# Altium schematic sheet wifi.SchDoc
size Legal; CompanyName: Brinton Engineering, LLC; Address1: 3479 Edison Way; Address2: Menlo Park CA 94025; Address3: +1 (877) 778-8435; Address4: brintonengineering.com; Revision: 1; SheetNumber: 1; SheetTotal: 1
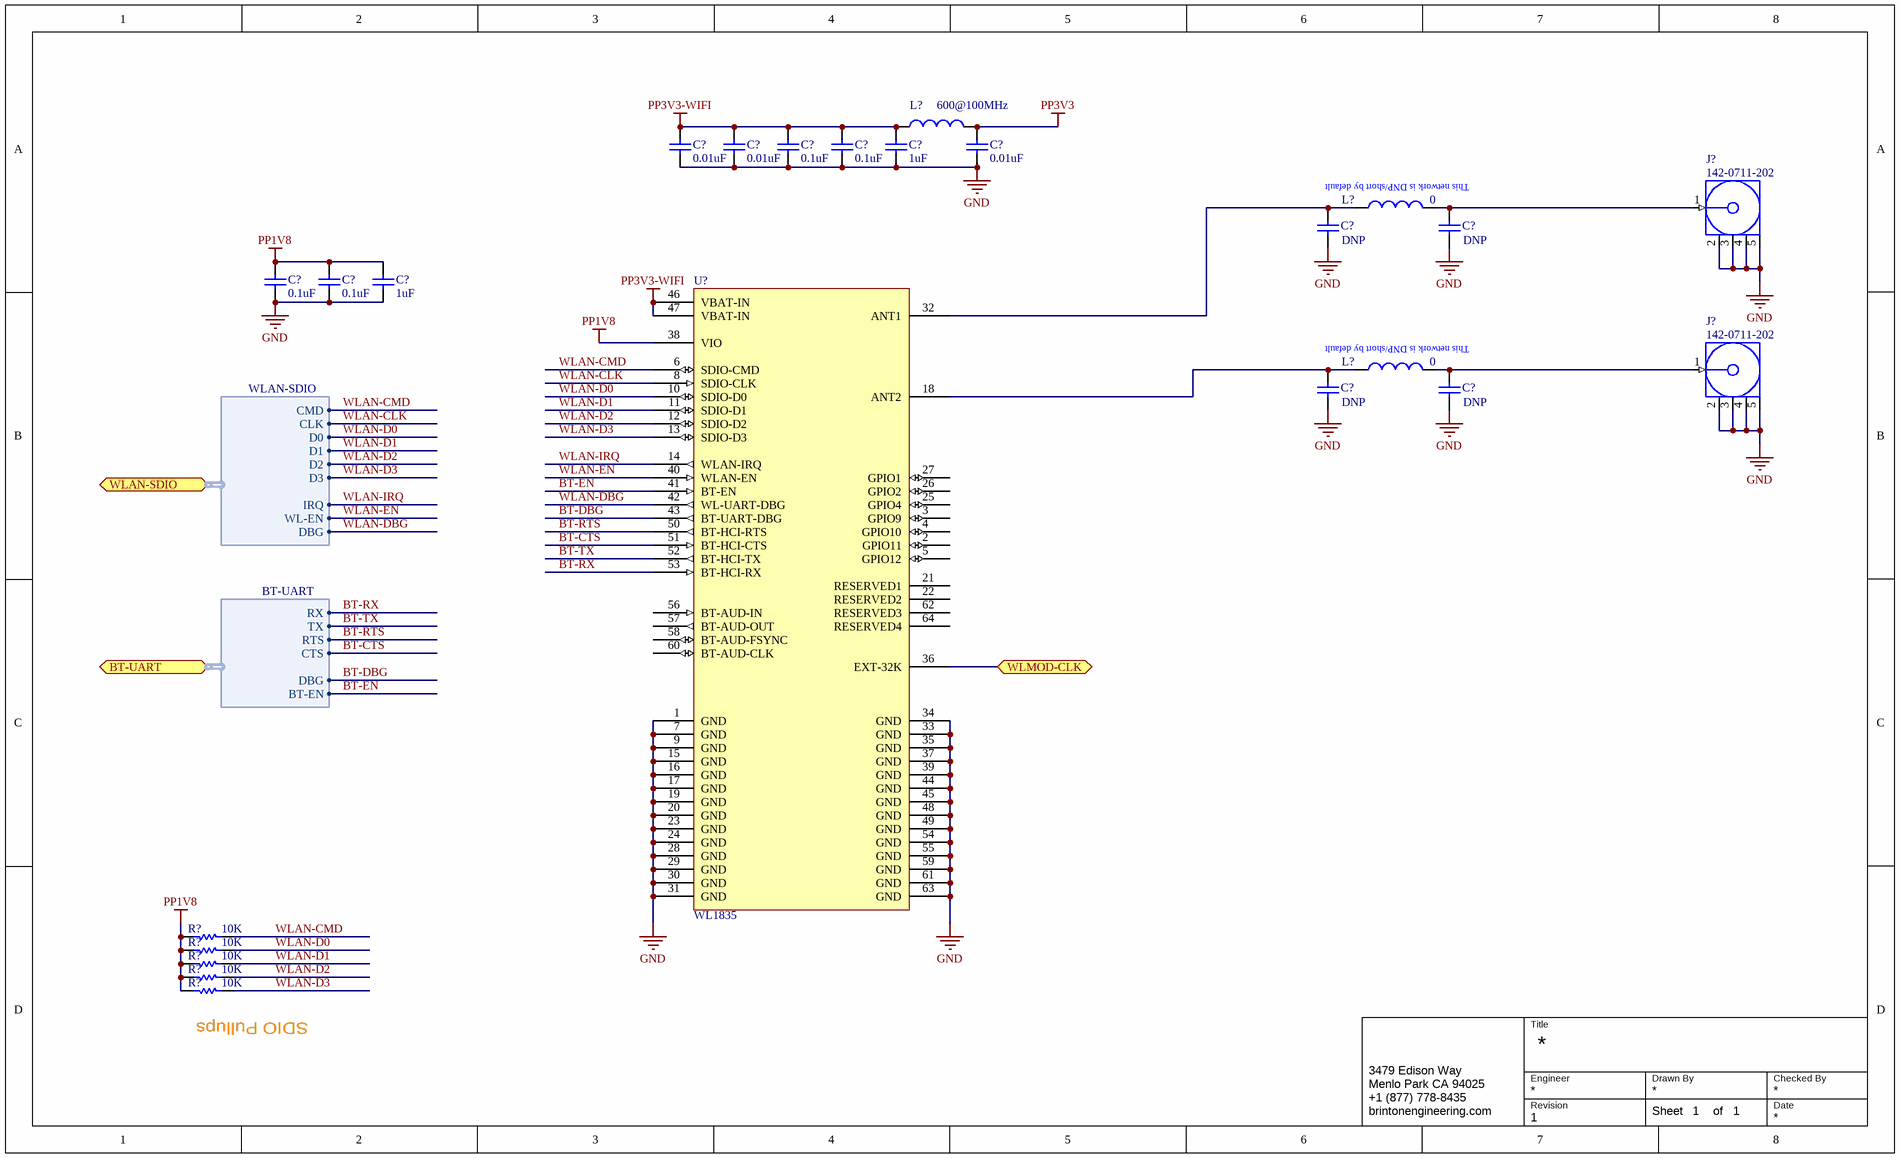
[diagram p0: wifi.SchDoc]

## Parts
(Parts that share a designator on the sheet are numbered #1, #2 ... from top to bottom, then left to right.)
C?#1  value 0.01uF  [0402]  (hidden comment: CAP 0402)
C?#2  value 0.01uF  [0402]  (hidden comment: CAP 0402)
C?#3  value 0.1uF  [0402]  (hidden comment: CAP 0402)
C?#4  value 0.1uF  [0402]  (hidden comment: CAP 0402)
C?#5  value 1uF  [0402]  (hidden comment: CAP 0402)
C?#6  value 0.01uF  [0402]  (hidden comment: CAP 0402)
C?#7  Do Not Populate: DNP  [0402]  (hidden comment: CAP 0402)
C?#8  Do Not Populate: DNP  [0402]  (hidden comment: CAP 0402)
C?#9  value 0.1uF  [0402]  (hidden comment: CAP 0402)
C?#10  value 0.1uF  [0402]  (hidden comment: CAP 0402)
C?#11  value 1uF  [0402]  (hidden comment: CAP 0402)
C?#12  Do Not Populate: DNP  [0402]  (hidden comment: CAP 0402)
C?#13  Do Not Populate: DNP  [0402]  (hidden comment: CAP 0402)
J?#1  142-0711-202  [142-0711-202]
J?#2  142-0711-202  [142-0711-202]
L?#1  value 600@100MHz  [0402]  (hidden comment: IND 0402)
L?#2  value 0  [0603]  (hidden comment: IND 0603)
L?#3  value 0  [0603]  (hidden comment: IND 0603)
R?#1  value 10K  [0402]  (hidden comment: RES 0402)
R?#2  value 10K  [0402]  (hidden comment: RES 0402)
R?#3  value 10K  [0402]  (hidden comment: RES 0402)
R?#4  value 10K  [0402]  (hidden comment: RES 0402)
R?#5  value 10K  [0402]  (hidden comment: RES 0402)
U?  WL1835

## Ports
BT-UART (harness BT-UART), WLAN-SDIO (harness WLAN-SDIO), WLMOD-CLK

## Harnesses
WLAN-SDIO: CMD, CLK, D0, D1, D2, D3, IRQ, WL-EN, DBG
BT-UART: RX, TX, RTS, CTS, DBG, BT-EN

## Nets
GND: C?#1.1 C?#2.1 C?#3.1 C?#4.1 C?#5.1 C?#6.1 C?#7.1 C?#8.1 C?#9.1 C?#10.1 C?#11.1 C?#12.1 C?#13.1 J?#1.2(GND) J?#1.3(GND) J?#1.4(GND) J?#1.5(GND) J?#2.2(GND) J?#2.3(GND) J?#2.4(GND) J?#2.5(GND) U?.1(GND) U?.7(GND) U?.9(GND) U?.15(GND) U?.16(GND) U?.17(GND) U?.19(GND) U?.20(GND) U?.23(GND) U?.24(GND) U?.28(GND) U?.29(GND) U?.30(GND) U?.31(GND) U?.33(GND) U?.34(GND) U?.35(GND) U?.37(GND) U?.39(GND) U?.44(GND) U?.45(GND) U?.48(GND) U?.49(GND) U?.54(GND) U?.55(GND) U?.59(GND) U?.61(GND) U?.63(GND)
PP1V8: C?#9.2 C?#10.2 C?#11.2 R?#1.1 R?#2.1 R?#3.1 R?#4.1 R?#5.1 U?.38(VIO)
PP3V3: C?#6.2 L?#1.1
PP3V3-WIFI: C?#1.2 C?#2.2 C?#3.2 C?#4.2 C?#5.2 L?#1.2 U?.46(VBAT-IN) U?.47(VBAT-IN)
BT-CTS: U?.51(BT-HCI-CTS) ; port BT-UART.CTS
BT-DBG: U?.43(BT-UART-DBG) ; port BT-UART.DBG
BT-EN: U?.41(BT-EN) ; port BT-UART.BT-EN
BT-RTS: U?.50(BT-HCI-RTS) ; port BT-UART.RTS
BT-RX: U?.53(BT-HCI-RX) ; port BT-UART.RX
BT-TX: U?.52(BT-HCI-TX) ; port BT-UART.TX
WLAN-CLK: U?.8(SDIO-CLK) ; port WLAN-SDIO.CLK
WLAN-CMD: R?#1.2 U?.6(SDIO-CMD) ; port WLAN-SDIO.CMD
WLAN-D0: R?#2.2 U?.10(SDIO-D0) ; port WLAN-SDIO.D0
WLAN-D1: R?#3.2 U?.11(SDIO-D1) ; port WLAN-SDIO.D1
WLAN-D2: R?#4.2 U?.12(SDIO-D2) ; port WLAN-SDIO.D2
WLAN-D3: R?#5.2 U?.13(SDIO-D3) ; port WLAN-SDIO.D3
WLAN-DBG: U?.42(WL-UART-DBG) ; port WLAN-SDIO.DBG
WLAN-EN: U?.40(WLAN-EN) ; port WLAN-SDIO.WL-EN
WLAN-IRQ: U?.14(WLAN-IRQ) ; port WLAN-SDIO.IRQ
WLMOD-CLK: U?.36(EXT-32K) ; port WLMOD-CLK
NetC?#7_2: C?#7.2 L?#2.1 U?.32(ANT1)
NetC?#8_2: C?#8.2 J?#1.1(Signal) L?#2.2
NetC?#12_2: C?#12.2 L?#3.1 U?.18(ANT2)
NetC?#13_2: C?#13.2 J?#2.1(Signal) L?#3.2

Not connected (* = marked no-connect by the designer): U? 2(GPIO11) 3(GPIO9) 4(GPIO10) 5(GPIO12) 21(RESERVED1) 22(RESERVED2) 25(GPIO4) 26(GPIO2) 27(GPIO1) 56(BT-AUD-IN) 57(BT-AUD-OUT) 58(BT-AUD-FSYNC) 60(BT-AUD-CLK) 62(RESERVED3) 64(RESERVED4)

## Notes on the sheet
- (near L?#2) This network is DNP/short by default
- (near L?#3) This network is DNP/short by default
- (near R?#5) SDIO Pullups
- Title
- Engineer
- Revision
- Drawn By
- Checked By
- Date
- Sheet
- of

## Library data of the parts
C?#1 C?#2 C?#6 = CAP 0402: Manufacturer: Murata; Manufacturer P/N: GRM155R71E103KA01D; Voltage: 25V; PCB Package: 0402
C?#3 C?#4 C?#9 C?#10 = CAP 0402: Manufacturer: Murata; Manufacturer P/N: GRM155R61A104KA01D; Voltage: 16V; PCB Package: 0402
C?#5 C?#11 = CAP 0402: Manufacturer: TDK; Manufacturer P/N: C1005X7S1A105K050BC; Voltage: 10V; PCB Package: 0402
C?#7 C?#8 C?#12 C?#13 = CAP 0402: Voltage: 50V; Value: DNP; PCB Package: 0402
J?#1 J?#2 = COAX-F: SMA Connector Jack; Standard Sex; SMD; Manufacturer: Emerson Connectivity; Manufacturer P/N: 142-0711-202
L?#1 = IND 0402: Inductor; Manufacturer: Murata; Manufacturer P/N: BLM15PX601SN1D; PCB Package: 0402
L?#2 L?#3 = IND 0603: Inductor; Manufacturer: Vishay; Manufacturer P/N: CRCW06030000Z0EA; PCB Package: 0603
R?#1-R?#5 = RES 0402: Resistor, SMD 0402; PCB Package: 0402; Manufacturer: *; Manufacturer P/N: *
U? = WL1835: WiLink Module, WiFi, BT, BLE; Manufacturer P/N: WL1835MOD; Manufacturer: Texas Instruments